# Altium schematic sheet PG04_Battery Charging.SchDoc: Smart Ring (Concept)
size B; Revision: 0.1
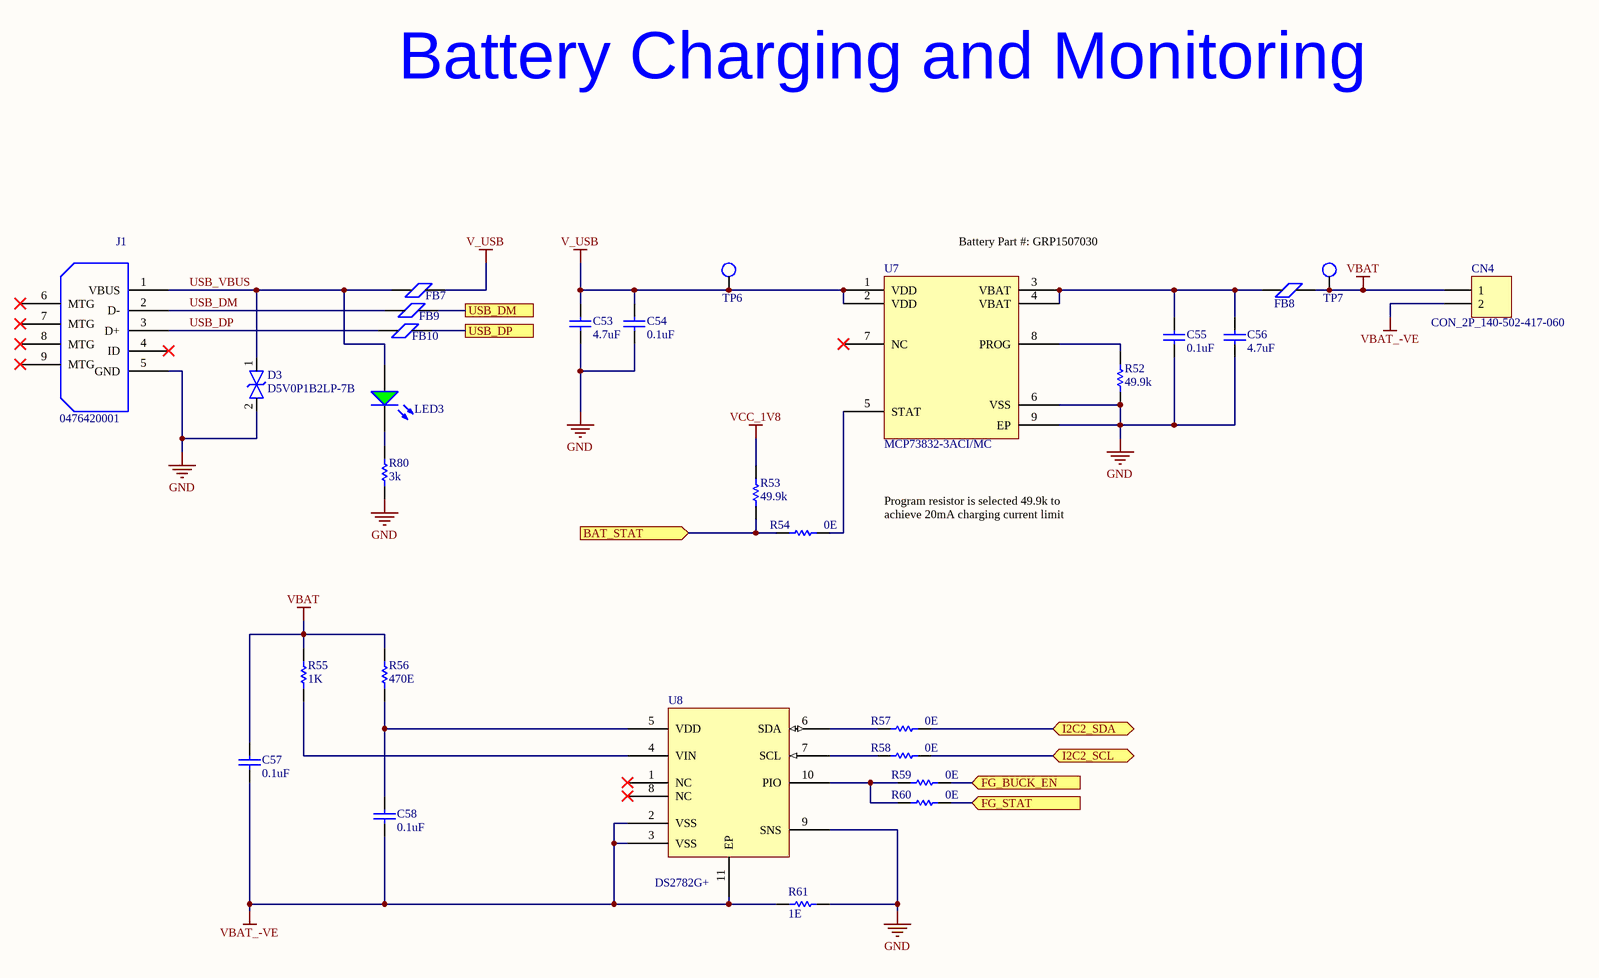
[diagram p0: PG04_Battery Charging.SchDoc]

## Parts
C53  4.7uF  [0805C]
C54  0.1uF  [0402C]
C55  0.1uF  [0402C]
C56  4.7uF  [0805C]
C57  0.1uF  [0402C]
C58  0.1uF  [0402C]
CN4  CON_2P_140-502-417-060  [140-502-417-060]
D3  D5V0P1B2LP-7B  [D5V0P1B2LP-7B]
FB7  Ferrite Bead  [0402R]  (value not drawn)
FB8  Ferrite Bead  [0402R]  (value not drawn)
FB9  Ferrite Bead  [0402R]  (value not drawn)
FB10  Ferrite Bead  [0402R]  (value not drawn)
J1  0476420001  [MOLEX_476420001]
LED3  LED_Green  [0402R]  (value not drawn)
R52  49.9k  [0402R]
R53  49.9k  [0402R]
R54  0E  [0402R]
R55  1K  [0402R]
R56  470E  [0402R]
R57  0E  [0402R]
R58  0E  [0402R]
R59  0E  [0402R]
R60  0E  [0402R]
R61  1E  [0402R]
R80  3k  [0402R]
TP6  Test_Point  [TP]  (value not drawn)
TP7  Test_Point  [TP]  (value not drawn)
U7  Battery Charger_MCP73832  [MCP73832-3ACI/MC]  (value not drawn)
U8  DS2782G+  [DS2782G+]

## Ports
BAT_STAT (in), FG_BUCK_EN (in), FG_STAT (in), I2C2_SCL (bidir), I2C2_SDA (bidir), USB_DM, USB_DP

## Nets
GND: C53.1 C54.1 C55.1 C56.1 D3.2 J1.5(GND) R52.1 R61.2 R80.1 U7.6(VSS) U7.9(EP) U8.9(SNS)
V_USB: C53.2 C54.2 FB7.2(VREF) TP6.1 U7.1(VDD) U7.2(VDD)
VBAT: C57.2 CN4.1 FB8.2(VREF) R55.2 R56.2 TP7.1
VBAT_-VE: C57.1 C58.1 CN4.2 R61.1 U8.2(VSS) U8.3(VSS) U8.11(EP)
VCC_1V8: R53.2
BAT_STAT: R53.1 R54.1 ; port BAT_STAT
FG_BUCK_EN: R59.2 ; port FG_BUCK_EN
FG_STAT: R60.2 ; port FG_STAT
I2C2_SCL: R58.2 ; port I2C2_SCL
I2C2_SDA: R57.2 ; port I2C2_SDA
USB_DM: FB9.1(VREF) J1.2(D-)
USB_DM: FB9.2(VREF) ; port USB_DM  [a separate net that carries the same name]
USB_DP: FB10.1(VREF) J1.3(D+)
USB_DP: FB10.2(VREF) ; port USB_DP  [a separate net that carries the same name]
USB_VBUS: D3.1 FB7.1(VREF) J1.1(VBUS) LED3.1(A)
NetC55_2: C55.2 C56.2 FB8.1(VREF) U7.3(VBAT) U7.4(VBAT)
NetC58_2: C58.2 R56.1 U8.5(VDD)
NetLED3_2: LED3.2(K) R80.2
NetR52_2: R52.2 U7.8(PROG)
NetR54_2: R54.2 U7.5(STAT)
NetR55_1: R55.1 U8.4(VIN)
NetR57_1: R57.1 U8.6(SDA)
NetR58_1: R58.1 U8.7(SCL)
NetR59_1: R59.1 R60.1 U8.10(PIO)

Not connected (* = marked no-connect by the designer): J1 4(ID)* 6(MTG)* 7(MTG)* 8(MTG)* 9(MTG)*; U7 7(NC)*; U8 1(NC)* 8(NC)*

## Notes on the sheet
- Battery Charging and Monitoring
- (near U7) Battery Part #: GRP1507030
- Program resistor is selected 49.9k to achieve 20mA charging current limit

## Library data of the parts
C53 C56 = CAP_0805_4.7uF_16V: CAP CER MLCC 4.7uF X7R 16V  0805; Alternate MFR: Murata Electronics; Alternate MPN: GRM21BR71C475ME51K; Package: 0805; Value: 4.7uF
C54 C55 C57 C58 = CAP_0402_0.1uF_50V: CAP CER 0.1UF 50V X7R 0402; Alternate MFR: Samsung Electro-Mechanics; Alternate MPN: CL05B104KB54PNC; Package: 0402; Value: 0.1uF
CN4 = CON_2P_140-502-417-060: 2.0MM PITCH CONNECTOR WITH 2 SUR; MFR: EDAC Inc.; MPN: 140-502-417-060
D3 = TVS_D5V0P1B2LP-7B: TVS DIODE 5.5VWM 13VC DFN1006-2; MFR: Diodes Incorporated; MPN: D5V0P1B2LP-7B; Package: X1-DFN1006-2
FB7-FB10 = Ferrite Bead: CHIP BEAD 600 OHM 0402 300mA; MFR: Walsin; MPN: WLBD1005K2U601TP; Package: 0402
J1 = Micro_USB_0476420001: CONN RCPT MICRO USB B 5POS SMD; Alternate MFR: Molex; Alternate MPN: 0476420001
LED3 = LED_Green: Red LED; MFR: Kingbright; Alternate MFR: Lite-On; Alternate MPN: LTST-C281KGKT; MPN: APG1005CGC-T; Value: Green; Forward Voltage: 2V; Package: 0402
R52 R53 = RES_0402_49.9k: RES 49.9K OHM 1% 1/16W 0402; MFR: Generic; Alternate MFR: YAGEO; Alternate MPN: RC0402FR-0749K9L; MPN: Generic; Package: 0402; Value: 49.9k
R54 R57-R60 = RES_0402_0E: RES 0 OHM JUMPER 1/16W 0402; MFR: Generic; Alternate MFR: YAGEO; Alternate MPN: AC0402JR-130RL; MPN: Generic; Package: 0402; Value: 0E
R55 = RES_0402_1k: RES SMD 1K OHM 1% 1/16W 0402; MFR: Generic; Alternate MFR: YAGEO; Alternate MPN: AC0402FR-071KL; MPN: Generic; Package: 0402; Value: 1K
R56 = RES_0402_470E: RES 470 OHM 1% 1/16W 0402; MFR: Generic; Alternate MFR: YAGEO; Alternate MPN: RC0402FR-07470RL; MPN: Generic; Package: 0402; Value: 470E
R61 = RES_0402_1E: RES 1 OHM 1% 1/16W 0402; MFR: Generic; Alternate MFR: YAGEO; Alternate MPN: RC0402FR-071RL; MPN: Generic; Package: 0402; Value: 1E
R80 = RES_0402_3k: RES SMD 3K OHM 0.1% 1/16W 0402; MFR: Vishay; MPN: MCS04020D3001BE000; Alternate MFR: Panasonic; Alternate MPN: ERA-2ARB302X; Package: 0402; Value: 3k
U7 = Battery Charger_MCP73832: IC BATT CONTRL LI-ION 1CELL 8DFN; MFR: Microchip; MPN: MCP73832-3ACI/MC; Package: 8-DFN (2x3)
U8 = DS2782G+: IC BATT MON LI-ION 1CELL 10TDFN; MFR: Maxim Integrated; MPN: DS2782G+; Package: 10-TDFN (3x4)